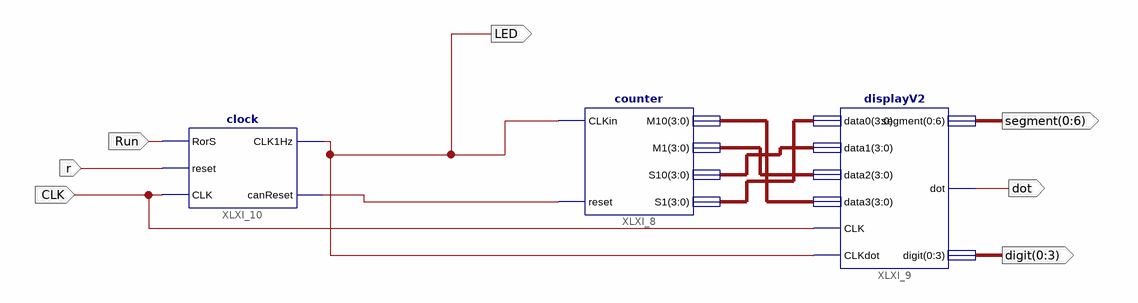
[diagram p0: schematic sheet 1]
// Xilinx ISE schematic Timer.sch (spartan6) as structural Verilog: 3 symbols, 7 ports
module Timer (
  input  Run,
  input  r,
  input  CLK,
  output LED,
  output [0:6] segment,
  output dot,
  output [0:3] digit
);

  wire XLXN_21;
  wire [3:0] XLXN_22, XLXN_23, XLXN_24, XLXN_25;

  counter XLXI_8 (.CLKin(LED), .reset(XLXN_21), .M10(XLXN_22), .M1(XLXN_23), .S10(XLXN_24), .S1(XLXN_25));
  displayV2 XLXI_9 (
    .data0(XLXN_25), .data1(XLXN_24), .data2(XLXN_23), .data3(XLXN_22), .CLK(CLK), .CLKdot(LED),
    .segment(segment), .dot(dot), .digit(digit));
  clock XLXI_10 (.reset(r), .RorS(Run), .CLK(CLK), .CLK1Hz(LED), .canReset(XLXN_21));
endmodule
